# EAGLE schematic untitled-power (EAGLE 8.2.1)
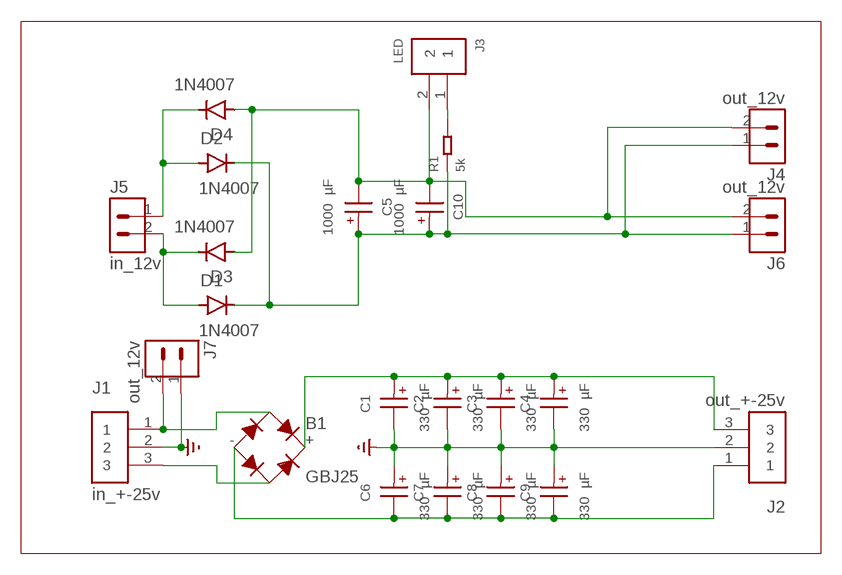
[diagram p0: schematic, sheet 1]

## Parts
B1  GBJ25  [GBJ]
C1  330 µF  WCAP-AT1H_18X35.5_860241081001  [WCAP-AT1H_18X35.5(DXL)]
C2  330 µF  WCAP-AT1H_18X35.5_860241081001  [WCAP-AT1H_18X35.5(DXL)]
C3  330 µF  WCAP-AT1H_18X35.5_860241081001  [WCAP-AT1H_18X35.5(DXL)]
C4  330 µF  WCAP-AT1H_18X35.5_860241081001  [WCAP-AT1H_18X35.5(DXL)]
C5  1000 µF  WCAP-ATET_10X25_860130375008  [WCAP-ATET_10X25(DXL)]
C6  330 µF  WCAP-AT1H_18X35.5_860241081001  [WCAP-AT1H_18X35.5(DXL)]
C7  330 µF  WCAP-AT1H_18X35.5_860241081001  [WCAP-AT1H_18X35.5(DXL)]
C8  330 µF  WCAP-AT1H_18X35.5_860241081001  [WCAP-AT1H_18X35.5(DXL)]
C9  330 µF  WCAP-AT1H_18X35.5_860241081001  [WCAP-AT1H_18X35.5(DXL)]
C10  1000 µF  WCAP-ATET_10X25_860130375008  [WCAP-ATET_10X25(DXL)]
D1  1N4007  [DO-41]
D2  1N4007  [DO-41]
D3  1N4007  [DO-41]
D4  1N4007  [DO-41]
J1  in_+-25v  691311400103  [TERMINALBLOCK_PLUGGABLE-3-7.62MM]
J2  out_+-25v  691311400103  [TERMINALBLOCK_PLUGGABLE-3-7.62MM]
J3  LED  61300211121  [61300211121]
J4  out_12v  B2P-VH(LF)(SN)  [HDR-02]
J5  in_12v  B2P-VH(LF)(SN)  [HDR-02]
J6  out_12v  B2P-VH(LF)(SN)  [HDR-02]
J7  out_12v  B2P-VH(LF)(SN)  [HDR-02]
R1  5k  DIP-RES-1M-5%-1/4W(PR-D2.3XL6.5MM)  [PR-D2.3XL6.5MM]

## Nets
GND: C1.2(-) C2.2(-) C3.2(-) C4.2(-) C6.1(+) C7.1(+) C8.1(+) C9.1(+) J1.2 J2.2 J7.1 ; supply symbol labelled SUPPLY0_GND_
N$1: D2.A D4.C J5.1
N$2: J3.1 R1.2
N$4: B1.AC1(A1) J1.1 J7.2
N$5: B1.AC2(A2) J1.3
N$6: B1.+ C1.1(+) C2.1(+) C3.1(+) C4.1(+) J2.3
N$7: B1.- C6.2(-) C7.2(-) C8.2(-) C9.2(-) J2.1
N$8: D1.A D3.C J5.2
N$9: C5.1(+) C10.1(+) D1.C D2.C J4.1 J6.1 R1.1
N$10: C5.2(-) C10.2(-) D3.A D4.A J3.2 J4.2 J6.2

## Library data of the parts
B1 = rectifier:GBJ25: BRIDGE RECTIFIER 25A GLASS PASSIVATED
C1-C4 C6-C9 = Wurth_Capacitors_WCAP-AT1H:WCAP-AT1H_18X35.5: WCAP-AT1H Aluminium Electrolytic Capacitors Long Life +105 °C Characteristics Long life product series Mounting style: THT Radial Capacitance range: 6.8 µF ‒ 3300 µF Capacitance tolerance: ±20 % Voltage range (UR): 10 ‒ 450 V(DC) Operating temperature: -40 °C up to +105 °C for UR ≤100 V(DC) -25 °C up to +105 °C for UR > 100 V(DC) Endurance: 5000 ‒ 10000 h @ +105 °C Dimensions (DxL) in mm: 5.0 x 11.0 up to 18.0 x 35.5 Recommended soldering: Wave soldering Applications Long life applications (industry, medical) Filtering Smoothing Energy storage Coupling e.g. Switched-mode power supply, AC/DC converter, adapter, charger, digital camera <https://www.we-online.com/catalog/media/o14727v209%20Family_WCAP-AT1H.jpg> Details see: https://www.we-online.com/catalog/en/WCAP-AT1H/ Updated by yingchun,Shan;2020-02-28 2020(C) Würth Elektronik; DATASHEET-URL: https://www.we-online.com/catalog/datasheet/860241081001.pdf; DF: 15%; DIAMETER: 18mm; I-LEAK: 2740uA; I-RIPPLE: 3220mA; L: 35.5mm; OPERATING-TEMPERATURE: -25 °C up to +105 °C; PART-NUMBER: 860241081001; PITCH: 7.5mm; TECHNICAL-REFERENCE: ATJL355331M200DSPAEK000; VR: 200V(DC)
C5 C10 = Wurth_Capacitors_WCAP-ATET:WCAP-ATET_10X25: WCAP-ATET Aluminium Electrolytic Capacitors High Temperature +125 °C Characteristics High operating temperature product series Mounting style: THT Radial Capacitance range: 0.47 µF ‒ 1000 µF Capacitance tolerance: ±20 % Voltage range (UR): 10 ‒ 350 V(DC) Operating temperature: -40 °C up to +125 °C for UR ≤100 V(DC) -25 °C up to +125 °C for UR >100 V(DC) Endurance: 1000 ‒ 2000 h @ +125 °C Dimensions (DxL) in mm: 5.0 x 11.0 up to 16.0 x 31.5 Recommended soldering: Wave soldering Applications High operating temperature applications Filtering Smoothing Energy storage Coupling e.g. Switched-mode power supply, AC/DC converter, adapter, charger, digital camera <https://www.we-online.com/catalog/media/o14728v209%20Family_WCAP-ATET.jpg> Details see: https://www.we-online.com/catalog/en/WCAP-ATET/ Updated by yingchun,Shan;2020-02-28 2020(C) Würth Elektronik; DATASHEET-URL: https://www.we-online.com/catalog/datasheet/860130375008.pdf; DF: 15%; DIAMETER: 10mm; I-LEAK: 160uA; I-RIPPLE: 950mA; L: 25mm; OPERATING-TEMPERATURE: -40 °C up to +125 °C; PART-NUMBER: 860130375008; PITCH: 5mm; TECHNICAL-REFERENCE: ATGF250102M016DSPAAB000; VR: 16V(DC)
D1-D4 = Diodes:1N4007: DIODE GEN PURP 1KV 1A DO41 Manufacturer's datasheet <https://www.mccsemi.com/pdf/Products/1N4001-1N4007(DO-41).pdf>; CREATED_BY: PCBLayout.com; DIGIKEY_PART_NUMBER: 1N4007MSCT-ND; MANUFACTURER: Micro Commercial Co; MPN: 1N4007; PACKAGE: DO-41
J1 J2 = Terminal Blocks:691311400103: 7.62MM CLOSE VERTICAL PCB HEADER WR-TBL Manufacturer's datasheet <https://katalog.we-online.com/em/datasheet/6913114001xx.pdf>; CREATED_BY: PCBLayout.com; DIGIKEY_PART_NO: 732-2824-ND; MANUFACTURER: WURTH ELEKTRONIK; MPN: 691311400103
J3 = Headers:61300211121: CONN HEADER VERT 2POS 2.54MM Manufacturer's datasheet <https://katalog.we-online.de/em/datasheet/6130xx11121.pdf>; CREATED_BY: PCBLayout.com; DIGI_KEY_PART_NUMBER: 732-5315-ND; MANUFACTURER: Wurth Electronics Inc.; MPN: 61300211121
J4-J7 = Connectors:B2P-VH(LF)(SN): CONN HEADER VERT 2POS 3.96MM Manufacturer's datasheet <http://www.jst-mfg.com/product/pdf/eng/eVH.pdf>; CREATED_BY: PCBLayout.com; DIGIKEY_PART_NUMBER: 455-1639-ND; MANUFACTURER: JST Sales America Inc.; MPN: B2P-VH(LF)(SN)
R1 = OPL_Resistor:DIP-RES-1M-5%-1/4W(PR-D2.3XL6.5MM): 301020005; MPN: FHCFR-1/4W-105J; VALUE: 1M